# Altium project nRF52840_NanoDevKit.PrjPcb
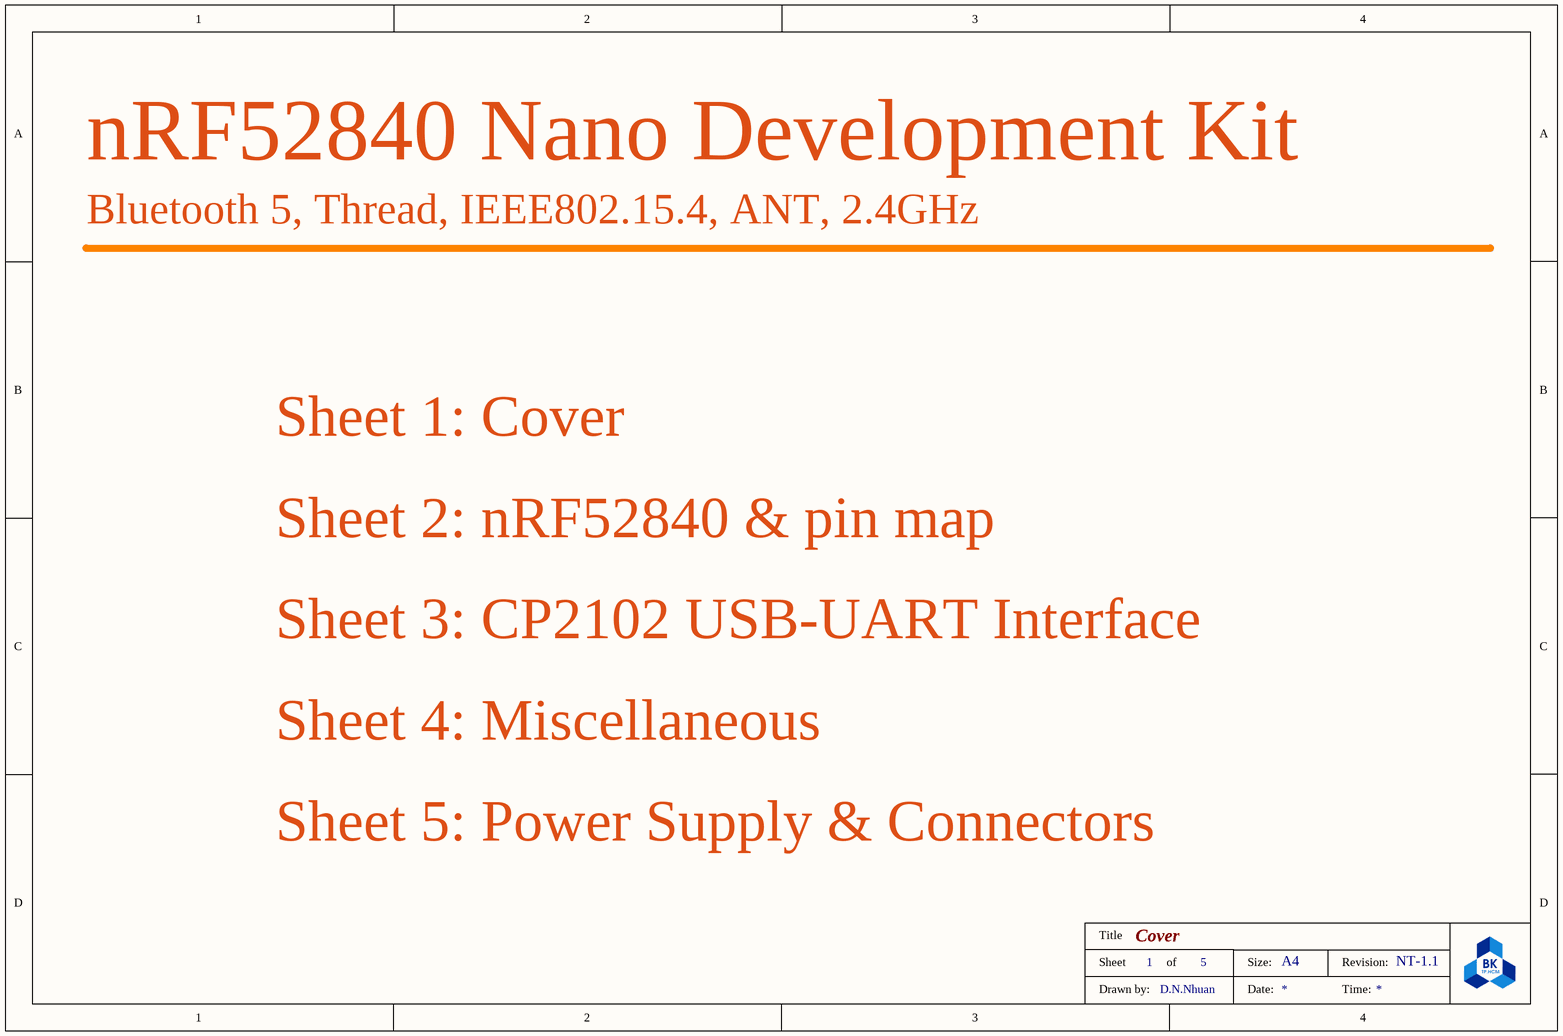
[diagram p0: Sheet1_Cover.SchDoc]
5 sheets, 72 parts. Net scope: flat (ports and power ports of the same name join across sheets).
Board file: PCB_NanoDevKit.PcbDoc
Sheets:
  Sheet1_Cover.SchDoc
  Sheet2_nRF52840_module.SchDoc
  Sheet3_CP2102.SchDoc
  Sheet4_misc.SchDoc
  Sheet5_PowerSupply&Connecters.SchDoc

## Sheet Sheet1_Cover.SchDoc: Cover
size A4; DrawnBy: D.N.Nhuan; Revision: NT-1.1; SheetNumber: 1; SheetTotal: 5

### Notes on the sheet
- nRF52840 Nano Development Kit
- Bluetooth 5, Thread, IEEE802.15.4, ANT, 2.4GHz
- Sheet 1: Cover
- Sheet 2: nRF52840 & pin map
- Sheet 3: CP2102 USB-UART Interface
- Sheet 4: Miscellaneous
- Sheet 5: Power Supply & Connectors
- Title
- Sheet
- of
- Size:
- A4
- Revision:
- Drawn by:
- Date:
- Time:

## Sheet Sheet2_nRF52840_module.SchDoc: nRF52840 module
size A4; DrawnBy: D.N.Nhuan; Revision: NT-1.1; SheetNumber: 2; SheetTotal: 5
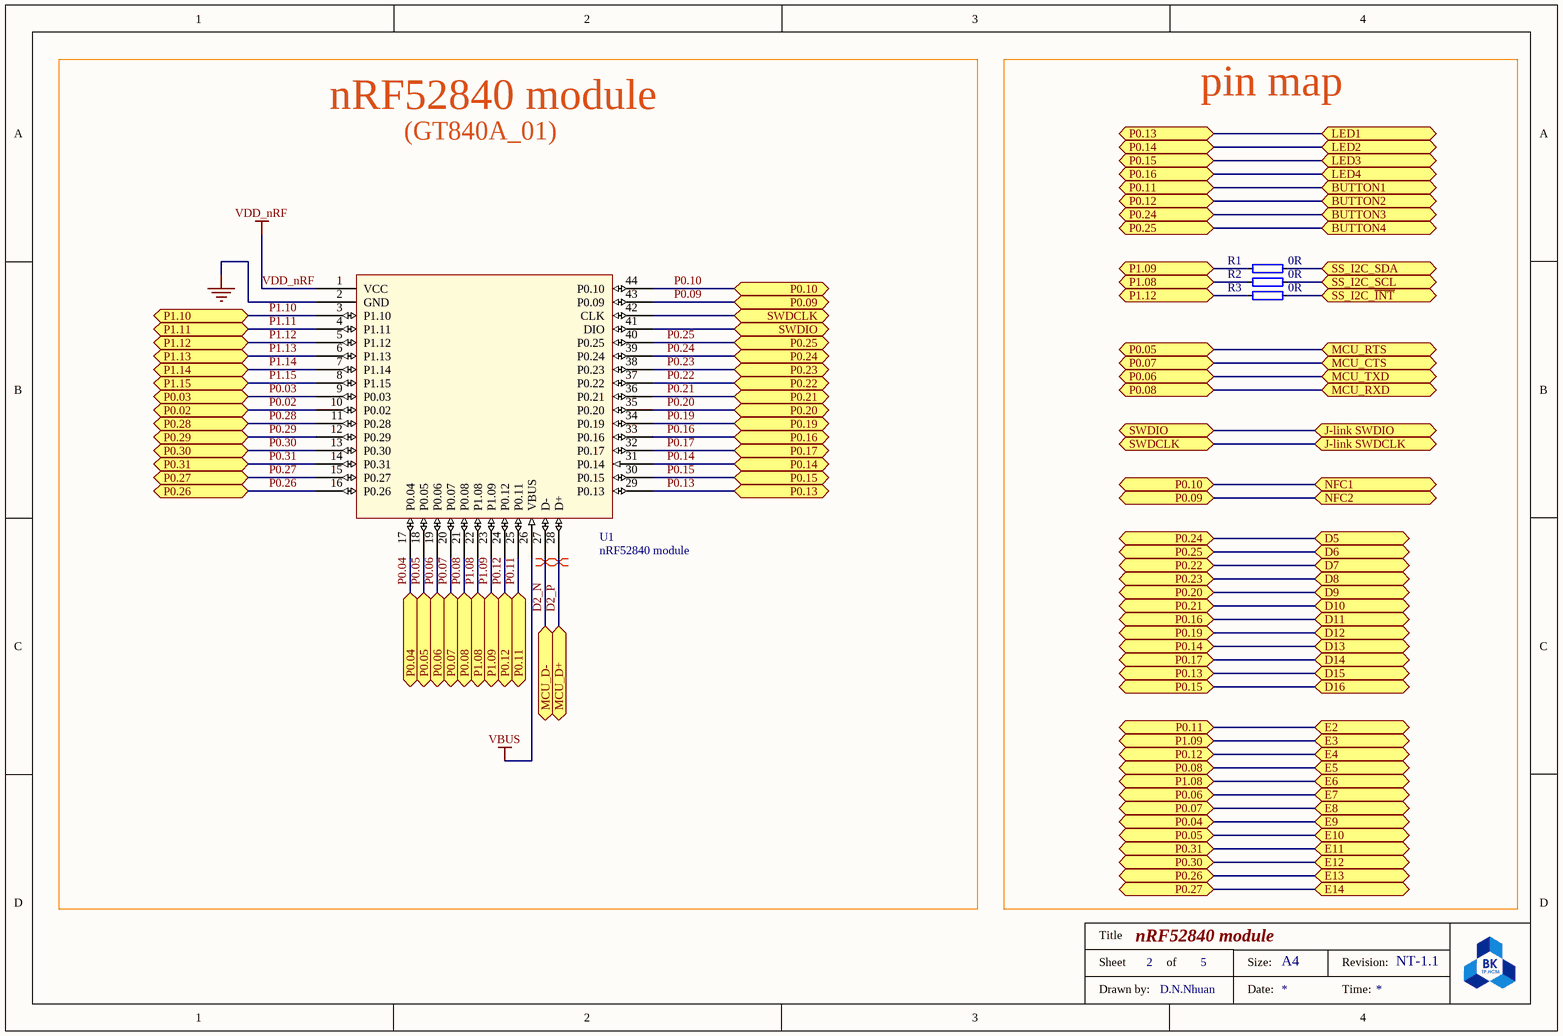
[diagram p1: Sheet2_nRF52840_module.SchDoc]

### Parts
R1  0R  [0402 imperial]
R2  0R  [0402 imperial]
R3  0R  [0402 imperial]
U1  nRF52840 module  [nRF52840_GT840A01]

### Blocks framed on the sheet
nRF52840 module: U1
pin map: R1-R3

### Ports
BUTTON1 (bidir), BUTTON2 (bidir), BUTTON3 (bidir), BUTTON4 (bidir), D5, D6, D7, D8, D9, D10, D11, D12, D13, D14, D15, D16, E2, E3, E4, E5, E6, E7, E8, E9, E10, E11, E12, E13, E14, J-link SWDCLK, J-link SWDIO, LED1 (bidir), LED2 (bidir), LED3 (bidir), LED4 (bidir), MCU_CTS, MCU_D+, MCU_D-, MCU_RTS, MCU_RXD, MCU_TXD, NFC1, NFC2, P0.02, P0.03, P0.04, P0.05, P0.06, P0.07, P0.08, P0.09, P0.10, P0.11, P0.12, P0.13, P0.14, P0.15, P0.16, P0.17, P0.19, P0.20, P0.21, P0.22, P0.23, P0.24, P0.25, P0.26, P0.27, P0.28, P0.29, P0.30, P0.31, P1.08, P1.09, P1.10, P1.11, P1.12, P1.13, P1.14, P1.15, SS_I2C_SCL, SS_I2C_SDA, SS_I2C_~{INT}, SWDCLK, SWDCLK (bidir), SWDIO, SWDIO (bidir)

### Nets
GND: U1.2(GND)
VBUS: U1.26(VBUS)
VDD_nRF: U1.1(VCC)
D2_N: U1.27(D-) ; port MCU_D-
D2_P: U1.28(D+) ; port MCU_D+
P0.02: U1.10(P0.02) ; port P0.02
P0.03: U1.9(P0.03) ; port P0.03
P0.04: U1.17(P0.04) ; port E9, port P0.04
P0.05: U1.18(P0.05) ; port MCU_RTS, port P0.05, port E10
P0.06: U1.19(P0.06) ; port MCU_TXD, port P0.06, port E7
P0.07: U1.20(P0.07) ; port MCU_CTS, port P0.07, port E8
P0.08: U1.21(P0.08) ; port MCU_RXD, port P0.08, port E5
P0.09: U1.43(P0.09) ; port P0.09, port NFC2
P0.10: U1.44(P0.10) ; port P0.10, port NFC1
P0.11: U1.25(P0.11) ; port BUTTON1, port P0.11, port E2
P0.12: U1.24(P0.12) ; port BUTTON2, port P0.12, port E4
P0.13: U1.29(P0.13) ; port LED1, port P0.13, port D15
P0.14: U1.31(P0.14) ; port LED2, port P0.14, port D13
P0.15: U1.30(P0.15) ; port LED3, port P0.15, port D16
P0.16: U1.33(P0.16) ; port LED4, port P0.16, port D11
P0.17: U1.32(P0.17) ; port P0.17, port D14
P0.19: U1.34(P0.19) ; port P0.19, port D12
P0.20: U1.35(P0.20) ; port P0.20, port D9
P0.21: U1.36(P0.21) ; port P0.21, port D10
P0.22: U1.37(P0.22) ; port P0.22, port D7
P0.23: U1.38(P0.23) ; port P0.23, port D8
P0.24: U1.39(P0.24) ; port BUTTON3, port P0.24, port D5
P0.25: U1.40(P0.25) ; port BUTTON4, port P0.25, port D6
P0.26: U1.16(P0.26) ; port P0.26, port E13
P0.27: U1.15(P0.27) ; port P0.27, port E14
P0.28: U1.11(P0.28) ; port P0.28
P0.29: U1.12(P0.29) ; port P0.29
P0.30: U1.13(P0.30) ; port P0.30, port E12
P0.31: U1.14(P0.31) ; port P0.31, port E11
P1.08: R2.1 U1.22(P1.08) ; port E6, port P1.08
P1.09: R1.1 U1.23(P1.09) ; port E3, port P1.09
P1.10: U1.3(P1.10) ; port P1.10
P1.11: U1.4(P1.11) ; port P1.11
P1.12: R3.1 U1.5(P1.12) ; port P1.12
P1.13: U1.6(P1.13) ; port P1.13
P1.14: U1.7(P1.14) ; port P1.14
P1.15: U1.8(P1.15) ; port P1.15
SWDCLK: U1.42(CLK) ; port J-link SWDCLK, port SWDCLK
SWDIO: U1.41(DIO) ; port SWDIO, port J-link SWDIO
NetR1_2: R1.2 ; port SS_I2C_SDA
NetR2_2: R2.2 ; port SS_I2C_SCL
NetR3_2: R3.2 ; port SS_I2C_~{INT}

### Layout directives
differential pair: D2_N, D2_P

### Notes on the sheet
- (GT840A_01)
- Title
- Sheet
- of
- Size:
- A4
- Revision:
- Drawn by:
- Date:
- Time:

### Library data of the parts
R1-R3 = Resistor: General Schematic; Tolerance: ±5%; Value: 0R; Supplier: *; Link of Supplier: *; Footprint: 0402
U1 = nRF52840_GT840A01: nRF52840 module GT840A_01

## Sheet Sheet3_CP2102.SchDoc: CP2102 USB-UART Interface
size A4; DrawnBy: D.N.Nhuan; Revision: NT-1.1; SheetNumber: 3; SheetTotal: 5
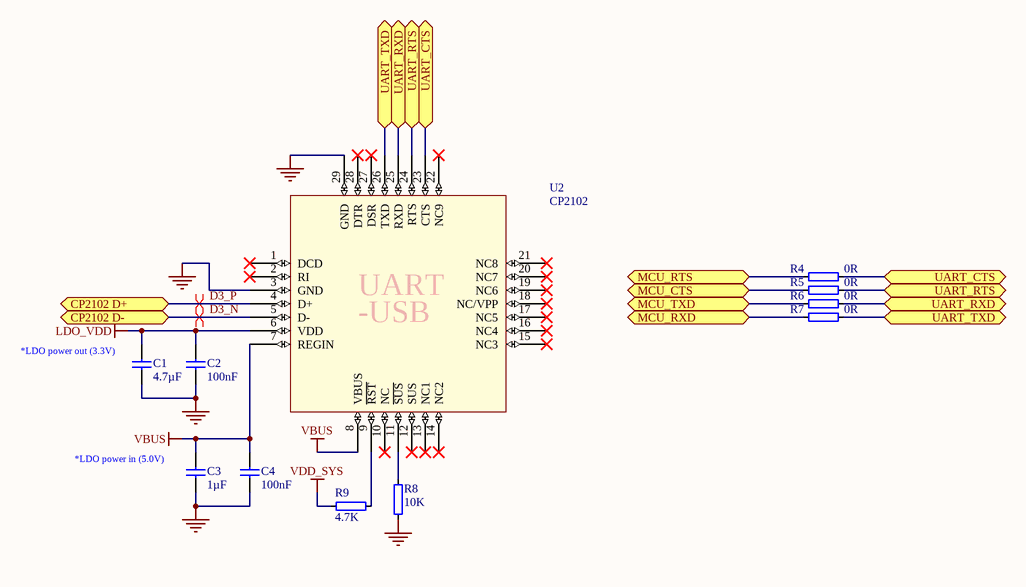
[diagram p2: Sheet3_CP2102.SchDoc]

### Parts
C1  4.7µF  [0603_Imperial]
C2  100nF  [0402 imperial]
C3  1µF  [0603_Imperial]
C4  100nF  [0402 imperial]
R4  0R  [0402 imperial]
R5  0R  [0402 imperial]
R6  0R  [0402 imperial]
R7  0R  [0402 imperial]
R8  10K  [0402 imperial]
R9  4.7K  [0402 imperial]
U2  CP2102  [QFN28-CP2102]

### Ports
CP2102 D+, CP2102 D-, MCU_CTS, MCU_RTS, MCU_RXD, MCU_TXD, UART_CTS, UART_RTS, UART_RXD, UART_TXD

### Nets
GND: C1.1 C2.1 C3.1 C4.1 R8.2 U2.3(GND) U2.29(GND)
LDO_VDD: C1.2 C2.2 U2.6(VDD)
VBUS: C3.2 C4.2 U2.7(REGIN) U2.8(VBUS)
VDD_SYS: R9.2
D3_N: U2.5(D-) ; port CP2102 D-
D3_P: U2.4(D+) ; port CP2102 D+
P0.05: R4.1 ; port MCU_RTS
P0.06: R6.1 ; port MCU_TXD
P0.07: R5.1 ; port MCU_CTS
P0.08: R7.1 ; port MCU_RXD
NetR4_2: R4.2 U2.23(CTS) ; port UART_CTS
NetR5_2: R5.2 U2.24(RTS) ; port UART_RTS
NetR6_2: R6.2 U2.25(RXD) ; port UART_RXD
NetR7_2: R7.2 U2.26(TXD) ; port UART_TXD
NetR8_1: R8.1 U2.11(~{SUS})
NetR9_1: R9.1 U2.9(~{RST})

Not connected (* = marked no-connect by the designer): U2 1(DCD)* 2(RI)* 10(NC)* 12(SUS)* 13(NC1)* 14(NC2)* 15(NC3)* 16(NC4)* 17(NC5)* 18(NC/VPP)* 19(NC6)* 20(NC7)* 21(NC8)* 22(NC9)* 27(DSR)* 28(DTR)*

### Layout directives
differential pair: D3_N, D3_P

### Notes on the sheet
- (near C1) *LDO power out (3.3V)
- (near C3) *LDO power in (5.0V)
- Title
- Sheet
- of
- Size:
- A4
- Revision:
- Drawn by:
- Date:
- Time:
- (in symbol CP2102) UART; -USB

### Library data of the parts
C1-C4 = Capacitor: Genaral Schematic; Tolerance: ±5%; Suppiler: *; Link of Supplier: *; Manufacturer: *; Manufacturer Part Number: *; Footprint: 0402
  C1: Value: 4.7µF
  C2 C4: Value: 100nF
  C3: Value: 1µF
R4-R9 = Resistor: General Schematic; Tolerance: ±5%; Supplier: *; Link of Supplier: *; Footprint: 0402
  R4-R7: Value: 0R
  R8: Value: 10K
  R9: Value: 4.7K
U2 = CP2102: Silicon Labs

## Sheet Sheet4_misc.SchDoc: Misc
size A4; DrawnBy: D.N.Nhuan; Revision: NT-1.1; SheetNumber: 4; SheetTotal: 5
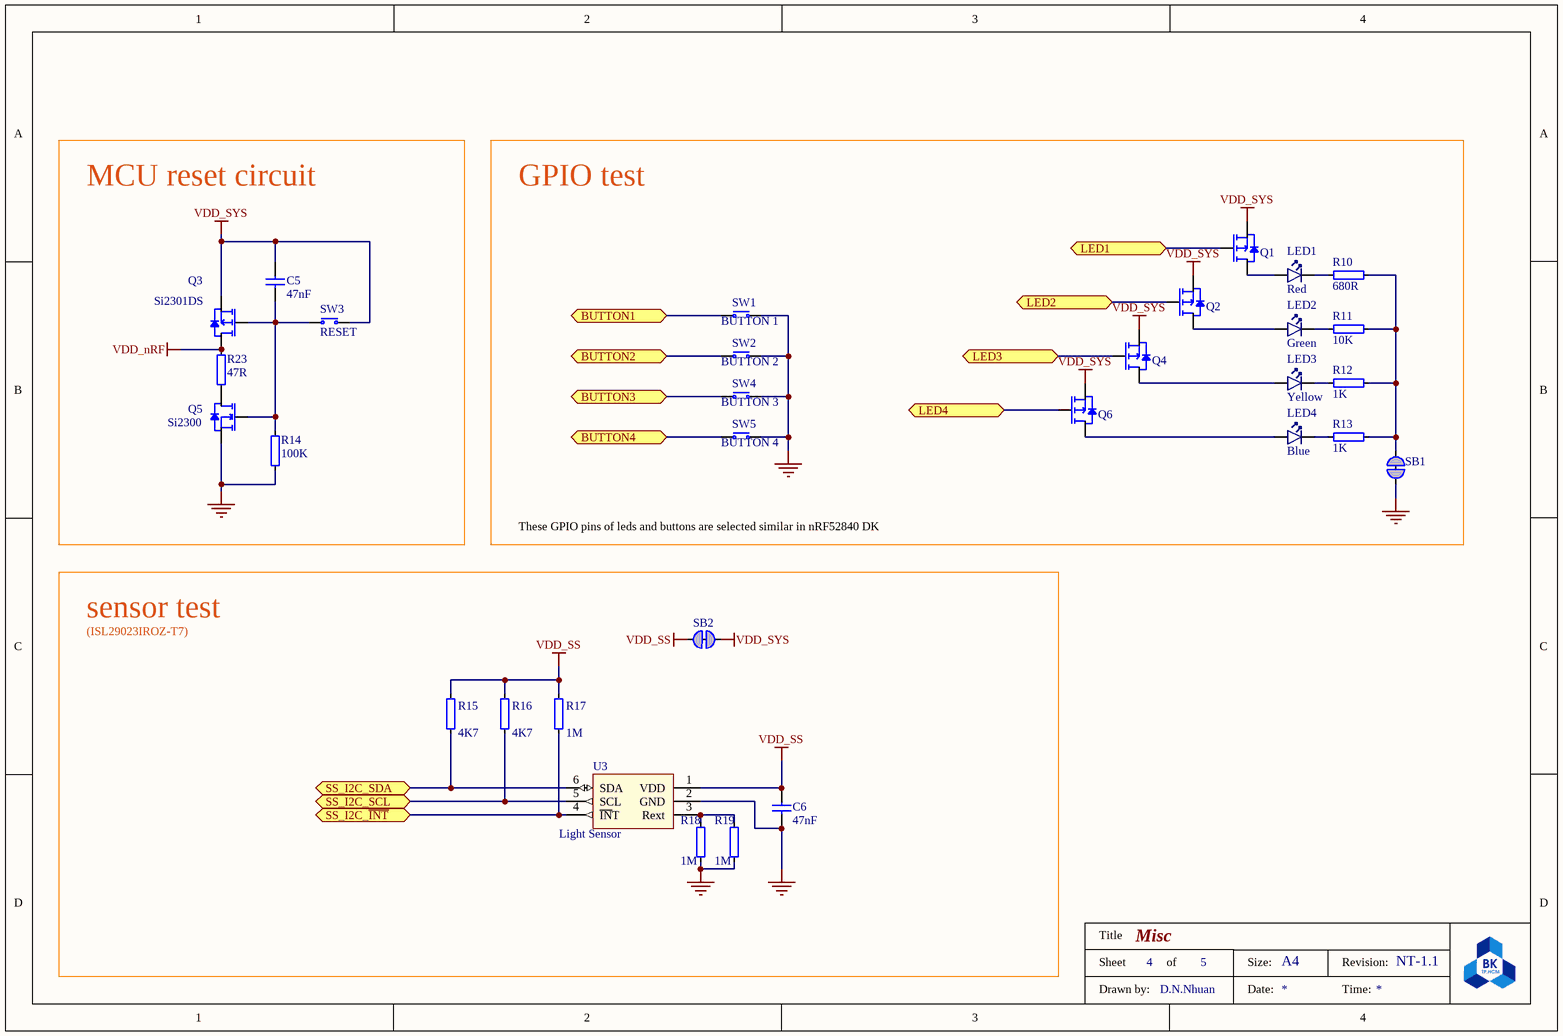
[diagram p3: Sheet4_misc.SchDoc]

### Parts
C5  47nF  [0402 imperial]
C6  47nF  [0402 imperial]
LED1  Red  [LED_0603]
LED2  Green  [LED_0603]
LED3  Yellow  [LED_0603]
LED4  Blue  [LED_0603]
Q1  Si2301DS  [SOT-23]  (value not drawn)
Q2  Si2301DS  [SOT-23]  (value not drawn)
Q3  Si2301DS  [SOT-23]
Q4  Si2301DS  [SOT-23]  (value not drawn)
Q5  Si2300  [SOT-23]
Q6  Si2301DS  [SOT-23]  (value not drawn)
R10  680R  [0805_Imperial]
R11  10K  [0805_Imperial]
R12  1K  [0805_Imperial]
R13  1K  [0805_Imperial]
R14  100K  [0402 imperial]
R15  4K7  [0402 imperial]
R16  4K7  [0402 imperial]
R17  1M  [0402 imperial]
R18  1M  [0402 imperial]
R19  1M  [0402 imperial]
R23  47R  [0805_Imperial]
SB1  Solderbridge  [Solderbridge_Shorted]  (value not drawn)  (net tie, no BOM)
SB2  Solderbridge  [Solderbridge_Shorted]  (value not drawn)  (net tie, no BOM)
SW1  BUTTON 1  [Switch-PB-4.5x4.5mm-SMD]
SW2  BUTTON 2  [Switch-PB-4.5x4.5mm-SMD]
SW3  RESET  [Switch-PB-4.5x4.5mm-SMD]
SW4  BUTTON 3  [Switch-PB-4.5x4.5mm-SMD]
SW5  BUTTON 4  [Switch-PB-4.5x4.5mm-SMD]
U3  Light Sensor  [SON65P200X210X80-7N]

### Blocks framed on the sheet
MCU reset circuit: C5 Q3 Q5 R14 R23 SW3
GPIO test: LED1-LED4 Q1 Q2 Q4 Q6 R10-R13 SB1 SW1 SW2 SW4 SW5
sensor test: C6 R15-R19 SB2 U3

### Ports
BUTTON1 (bidir), BUTTON2 (bidir), BUTTON3 (bidir), BUTTON4 (bidir), LED1 (bidir), LED2 (bidir), LED3 (bidir), LED4 (bidir), SS_I2C_SCL, SS_I2C_SDA, SS_I2C_~{INT}

### Nets
GND: C6.1 Q5.2(S) R14.1 R18.1 R19.1 SB1.2 SW1.1(N.O) SW2.1(N.O) SW4.1(N.O) SW5.1(N.O) U3.2(GND) U3.7(GND)
VDD_nRF: Q3.3(D) R23.2
VDD_SS: C6.2 R15.2 R16.2 R17.2 SB2.2 U3.1(VDD)
VDD_SYS: C5.2 Q1.2(S) Q2.2(S) Q3.2(S) Q4.2(S) Q6.2(S) SB2.1 SW3.1(N.O)
P0.11: SW1.2(COM) ; port BUTTON1
P0.12: SW2.2(COM) ; port BUTTON2
P0.13: Q1.1(G) ; port LED1
P0.14: Q2.1(G) ; port LED2
P0.15: Q4.1(G) ; port LED3
P0.16: Q6.1(G) ; port LED4
P0.24: SW4.2(COM) ; port BUTTON3
P0.25: SW5.2(COM) ; port BUTTON4
NetC5_1: C5.1 Q3.1(G) Q5.1(G) R14.2 SW3.2(COM)
NetLED1_1: LED1.1(C) R10.1
NetLED1_2: LED1.2(A) Q1.3(D)
NetLED2_1: LED2.1(C) R11.1
NetLED2_2: LED2.2(A) Q2.3(D)
NetLED3_1: LED3.1(C) R12.1
NetLED3_2: LED3.2(A) Q4.3(D)
NetLED4_1: LED4.1(C) R13.1
NetLED4_2: LED4.2(A) Q6.3(D)
NetQ5_3: Q5.3(D) R23.1
NetR1_2: R15.1 U3.6(SDA) ; port SS_I2C_SDA
NetR2_2: R16.1 U3.5(SCL) ; port SS_I2C_SCL
NetR3_2: R17.1 U3.4(~{IN}T) ; port SS_I2C_~{INT}
NetR10_2: R10.2 R11.2 R12.2 R13.2 SB1.1
NetR18_2: R18.2 R19.2 U3.3(Rext)

### Notes on the sheet
- These GPIO pins of leds and buttons are selected similar in nRF52840 DK
- (ISL29023IROZ-T7)
- Title
- Sheet
- of
- Size:
- A4
- Revision:
- Drawn by:
- Date:
- Time:

### Library data of the parts
C5 C6 = Capacitor: Genaral Schematic; Tolerance: ±5%; Value: 47nF; Suppiler: *; Link of Supplier: *; Manufacturer: *; Manufacturer Part Number: *; Footprint: 0402
LED1-LED4 = LED: General Schematic; Footprint: 0603
  LED1: Color: Red
  LED2: Color: Green
  LED3: Color: Yellow
  LED4: Color: Blue
Q1-Q4 Q6 = MOS-P: SOT-23 1-G 2-S 3-D
Q5 = MOS-N: SOT-23 1-G 2-S 3-D
R10-R17 R23 = Resistor: General Schematic; Tolerance: ±5%; Supplier: *; Link of Supplier: *; Footprint: 0402
  R10: Value: 680R
  R11: Value: 10K
  R12 R13: Value: 1K
  R14: Value: 100K
  R15 R16: Value: 4K7
  R17: Value: 1M
  R23: Value: 47R
R18 R19 = Resistor: General Schematic; Tolerance: ±1%; Value: 1M; Supplier: thegioiic; Link of Supplier: http://thegioiic.com/products/dien-tro-510k-ohm-0402-1; Footprint: 0402
SB1 SB2 = Solderbridge Shorted: Shorted Solderbridge; Artikkelnr Noca: N.A.; Part Number: Solderbridge Shorted; Manufacturer: *; Manufacturer Part Number: *; Datasheet: *; LatestRevisionDate: 2012-08-07; Pin Count: 2; Publisher: Nordic Semiconductor; Published: 2012-08-07; Value: Solderbridge; Note: *; Supplier: *; Supplier part number: *; 2nd source Supplier: *; 2nd source part number: *; Footprint Doc: Solderbridge_Shorted; Artikkelnr Simpro: N.A.
SW1-SW5 = Switch-PB: Push Button; Manufacturer: *; Manufacturer Part Number: *; Pin Count: 4; Note: *; Part Number: *
  SW1: Value: BUTTON 1
  SW2: Value: BUTTON 2
  SW3: Value: RESET
  SW4: Value: BUTTON 3
  SW5: Value: BUTTON 4
U3 = ISL29023IROZ-T7: Light Sensor, 2.1x2mm; Manufacturer: Intersil; Footprint: DFN 6; Manufacturer Partnumber: ISL29023IROZ-T7; Type Sensor: Light Sensor

## Sheet Sheet5_PowerSupply&Connecters.SchDoc: Power Supply & Connectors
size A4; DrawnBy: D.N.Nhuan; Revision: NT-1.1; SheetNumber: 5; SheetTotal: 5
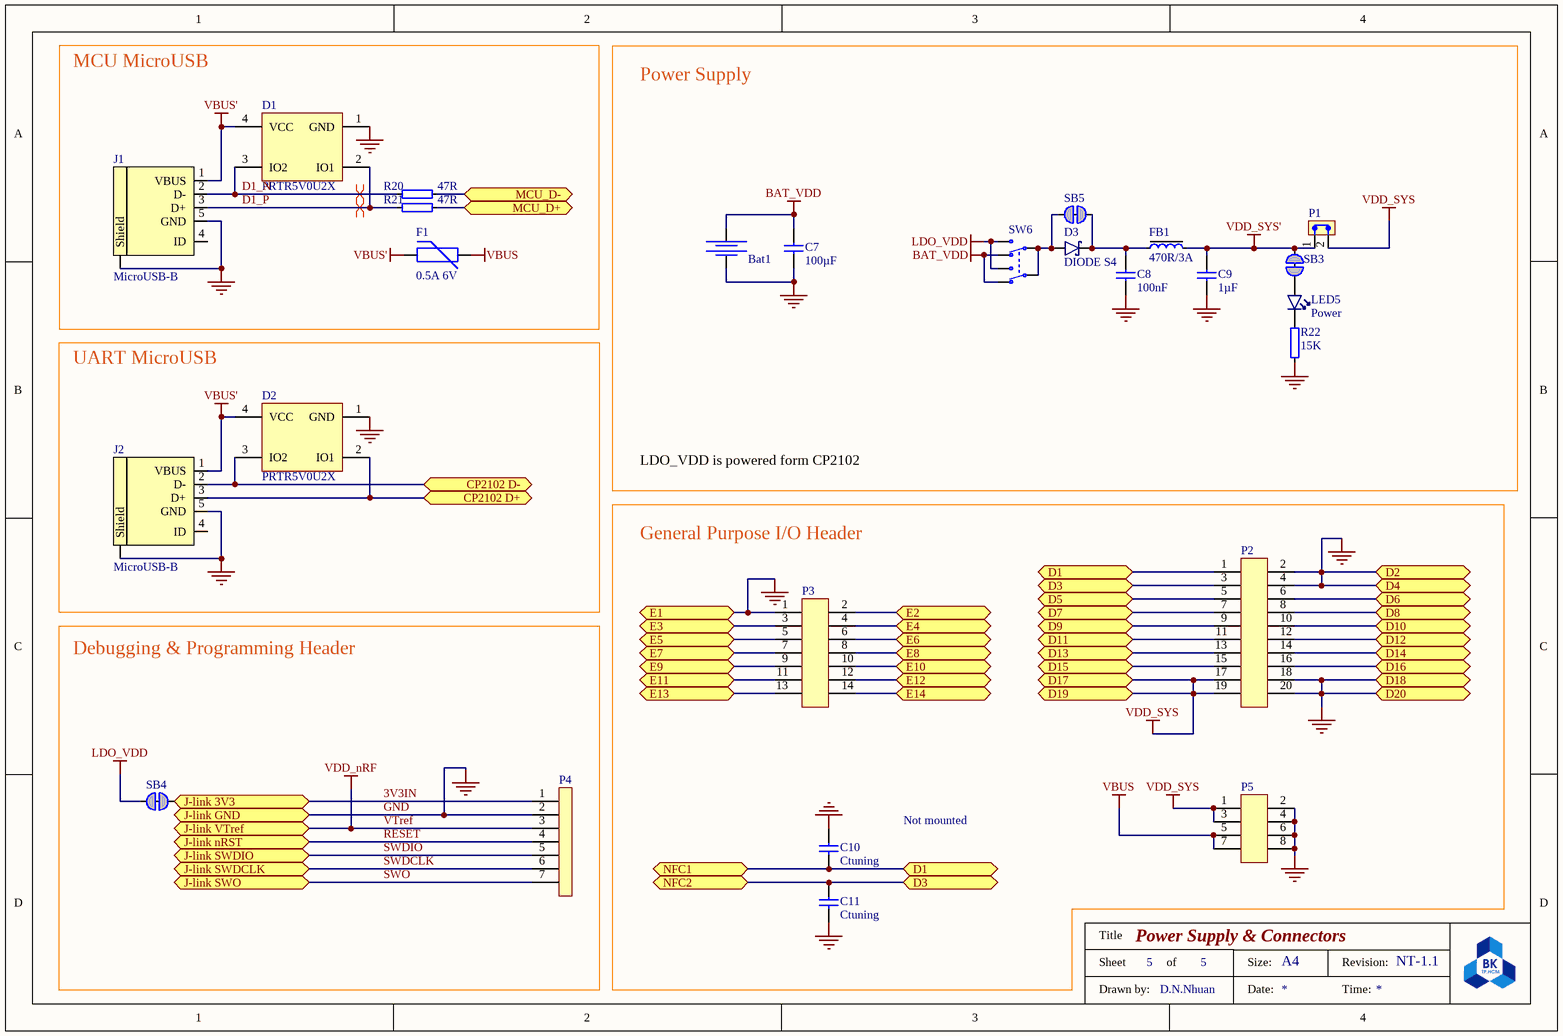
[diagram p4: Sheet5_PowerSupply&Connecters.SchDoc]

### Parts
Bat1  Bat Holder CR2032  [CR2032_HOLDER]  (value not drawn)
C7  100µF  [1210_Imperial]
C8  100nF  [0402 imperial]
C9  1µF  [0603_Imperial]
C10  Ctuning  [0402 imperial]
C11  Ctuning  [0402 imperial]
D1  PRTR5V0U2X  [SOT190P230X110-4L]
D2  PRTR5V0U2X  [SOT190P230X110-4L]
D3  DIODE S4  [SOD-123]
F1  0.5A 6V  [0805_Imperial]
FB1  470R/3A  [0603_Imperial]
J1  MicroUSB-B  [USB-Micro-B-RA-SMD-PiP]
J2  MicroUSB-B  [USB-Micro-B-RA-SMD-PiP]
LED5  Power  [LED_0603]
P1  2p, 2.54mm  [CONN2.54MM2P]  (value not drawn)
P2  10x2, 2.54mm  [CONN2.54MM10X2]  (value not drawn)
P3  2x7p, 2.54mm  [CONN2.54MM7PX2]  (value not drawn)
P4  Debug&Programming  [CONN2.54MM7P]  (value not drawn)
P5  2x4p, 2.54mm  [CONN2.54MM2X4]  (value not drawn)
R20  47R  [0402 imperial]
R21  47R  [0402 imperial]
R22  15K  [0402 imperial]
SB3  Solderbridge  [Solderbridge_Shorted]  (value not drawn)  (net tie, no BOM)
SB4  Solderbridge  [Solderbridge_Shorted]  (value not drawn)  (net tie, no BOM)
SB5  Solderbridge  [Solderbridge_Shorted]  (value not drawn)  (net tie, no BOM)
SW6  MSS22D18  [MSS22D18SMD]  (value not drawn)

### Blocks framed on the sheet
MCU MicroUSB: D1 F1 J1 R20 R21
Power Supply: Bat1 C7-C9 D3 FB1 LED5 P1 R22 SB3 SB5 SW6
UART MicroUSB: D2 J2
General Purpose I/O Header: C10 C11 P2 P3 P5
Debugging & Programming Header: P4 SB4

### Ports
CP2102 D+, CP2102 D-, D1, D2, D3, D4, D5, D6, D7, D8, D9, D10, D11, D12, D13, D14, D15, D16, D17, D18, D19, D20, E1, E2, E3, E4, E5, E6, E7, E8, E9, E10, E11, E12, E13, E14, J-link 3V3, J-link GND, J-link nRST, J-link SWDCLK, J-link SWDIO, J-link SWO, J-link VTref, MCU_D+, MCU_D-, NFC1, NFC2

### Nets
BAT_VDD: Bat1.1 C7.2 SW6.3(N.C-1) SW6.6(N.C-2)
GND: Bat1.2 C7.1 C8.1 C9.1 C10.2 C11.1 D1.1(GND) D2.1(GND) J1.5(GND) J1.6(Shield) J2.5(GND) J2.6(Shield) P2.2 P2.4 P2.18 P2.20 P3.1 P4.2 P5.2 P5.4 P5.6 P5.8 R22.1 ; port J-link GND, port D2, port D4, port D18, port D20, port E1
LDO_VDD: SB4.1 SW6.1(N.O-1) SW6.4(N.O-2)
VBUS: F1.2 P5.5 P5.7
VBUS': D1.4(VCC) D2.4(VCC) F1.1 J1.1(VBUS) J2.1(VBUS)
VDD_nRF: P4.3 ; port J-link VTref  [also labelled VTref]
VDD_SYS: P1.2 P2.17 P2.19 P5.1 P5.3 ; port D17, port D19
VDD_SYS': C9.2 FB1.2 P1.1 SB3.1
3V3IN: P4.1 SB4.2 ; port J-link 3V3
D1_N: D1.3(IO2) J1.2(D-) R20.1
D1_P: D1.2(IO1) J1.3(D+) R21.1
D2_N: R20.2 ; port MCU_D-
D2_P: R21.2 ; port MCU_D+
D3_N: D2.3(IO2) J2.2(D-) ; port CP2102 D-
D3_P: D2.2(IO1) J2.3(D+) ; port CP2102 D+
P0.04: P3.9 ; port E9
P0.05: P3.10 ; port E10
P0.06: P3.7 ; port E7
P0.07: P3.8 ; port E8
P0.08: P3.5 ; port E5
P0.09: C11.2 P2.3 ; port D3, port NFC2
P0.10: C10.1 P2.1 ; port D1, port NFC1
P0.11: P3.2 ; port E2
P0.12: P3.4 ; port E4
P0.13: P2.15 ; port D15
P0.14: P2.13 ; port D13
P0.15: P2.16 ; port D16
P0.16: P2.11 ; port D11
P0.17: P2.14 ; port D14
P0.19: P2.12 ; port D12
P0.20: P2.9 ; port D9
P0.21: P2.10 ; port D10
P0.22: P2.7 ; port D7
P0.23: P2.8 ; port D8
P0.24: P2.5 ; port D5
P0.25: P2.6 ; port D6
P0.26: P3.13 ; port E13
P0.27: P3.14 ; port E14
P0.30: P3.12 ; port E12
P0.31: P3.11 ; port E11
P1.08: P3.6 ; port E6
P1.09: P3.3 ; port E3
RESET: P4.4 ; port J-link nRST
SWDCLK: P4.6 ; port J-link SWDCLK
SWDIO: P4.5 ; port J-link SWDIO
SWO: P4.7 ; port J-link SWO
NetC8_2: C8.2 D3.1(C) FB1.1 SB5.1
NetD3_2: D3.2(A) SB5.2 SW6.2(COM-1) SW6.5(COM-2)
NetLED5_1: LED5.1(C) R22.2
NetLED5_2: LED5.2(A) SB3.2

Not connected (* = marked no-connect by the designer): J1 4(ID); J2 4(ID)

### Layout directives
differential pair: D1_N, D1_P

### Notes on the sheet
- LDO_VDD is powered form CP2102
- Not mounted
- Title
- Sheet
- of
- Size:
- A4
- Revision:
- Drawn by:
- Date:
- Time:

### Library data of the parts
Bat1 = Bat Holder CR2032: Bat Holder CR2032 SMD; Note: Bat Holder CR2032
C7-C11 = Capacitor: Genaral Schematic; Tolerance: ±5%; Suppiler: *; Link of Supplier: *; Manufacturer: *; Manufacturer Part Number: *; Footprint: 0402
  C7: Value: 100µF
  C8: Value: 100nF
  C9: Value: 1µF
  C10 C11: Value: Ctuning
D1 D2 = PRTR5V0U2X: Ultra low capacitance double rail-to-rail ESD protection diode; Manufacturer: NXP; 2nd source part number: 152-4157; Artikkelnr Noca: 10069015; Artikkelnr Simpro: N.A.; Part Number: PRTR5V0U2X; Manufacturer Part Number: PRTR5V0U2X; Datasheet: http://www.farnell.com/datasheets/109718.pdf; LatestRevisionDate: 2012-06-11; Publisher: Nordic Semiconductor; Published: 2012-06-11; Value: PRTR5V0U2X; Note: *; Supplier: Digi-Key; Supplier part number: 568-4140-1-ND; 2nd source Supplier: Farnell; Footprint Doc: SOT-143B
D3 = Diode Schottky: Value: DIODE S4; Note: *
F1 = Fuse: Fuse Fuse Fuse; Value: 0.5A 6V
FB1 = Ferrite Bead: General FB; Footprint: 0603; Value: 470R/3A
J1 J2 = MiniUSB-AB-SMT: MicroUSB-B-SMT; Manufacturer: Allen Creations Corp.; Manufacturer Part Number: AJU55-BS2111-L; 2nd source part number: 609-4616-1-ND; Part number IPS: 00000007790; Artikkelnr Noca: 55029020; Artikkelnr Simpro: N.A.; Part Number: USB-Micro-B-RA-SMD-PiP; Datasheet: \\hizz\pro\app9717\Datasheet\connectores\Allen Creations Corp\AJU-211.pdf; Footprint Doc: USB-Micro-B-RA-SMD-PiP; LatestRevisionDate: 2016-04-21; Pin Count: 5; Publisher: Nordic Semiconductor; Published: 2014-10-07; Value: MicroUSB-B; Note: *; Supplier: Cabcon; Supplier part number: AJU55-BS2111-L; 2nd source Supplier: Digi-Key
LED5 = LED: General Schematic; Color: Green; Footprint: 0603; Indicate: Power
P1 = Headerx 2: Value: 2p, 2.54mm
P2 = Header 10x2: General Schematic; Value: 10x2, 2.54mm
P3 = Header 7x2: General Schematic; Value: 2x7p, 2.54mm
P4 = Header 7: General Schematic; Value: Debug&Programming
P5 = Header 4x2: General Schematic; Value: 2x4p, 2.54mm
R20-R22 = Resistor: General Schematic; Tolerance: ±5%; Supplier: *; Link of Supplier: *; Footprint: 0402
  R20 R21: Value: 47R
  R22: Value: 15K
SB3-SB5 = Solderbridge Shorted: as SB1 on sheet Sheet4_misc; Part Number: Solderbridge Shorted; Manufacturer: *; Manufacturer Part Number: *; Datasheet: *; LatestRevisionDate: 2012-08-07; Pin Count: 2; Publisher: Nordic Semiconductor; Published: 2012-08-07; Value: Solderbridge; Note: *; Supplier: *; Supplier part number: *; 2nd source Supplier: *; 2nd source part number: *; Footprint Doc: Solderbridge_Shorted; Artikkelnr Simpro: N.A.
SW6 = MSS22D18: Slide Switch DPDT; Part Number: *; Manufacturer Part Number: *; Pin Count: 6; Value: MSS22D18; Note: *

## Nets that join several sheets
GND: Sheet2_nRF52840_module (U1.2), Sheet3_CP2102 (7 pins), Sheet4_misc (12 pins), Sheet5_PowerSupply&Connecters (23 pins)
LDO_VDD: Sheet3_CP2102 (C1.2 C2.2 U2.6), Sheet5_PowerSupply&Connecters (SB4.1 SW6.1 SW6.4)
VBUS: Sheet2_nRF52840_module (U1.26), Sheet3_CP2102 (C3.2 C4.2 U2.7 U2.8), Sheet5_PowerSupply&Connecters (F1.2 P5.5 P5.7)
VDD_nRF: Sheet2_nRF52840_module (U1.1), Sheet4_misc (Q3.3 R23.2), Sheet5_PowerSupply&Connecters (P4.3)
VDD_SYS: Sheet3_CP2102 (R9.2), Sheet4_misc (8 pins), Sheet5_PowerSupply&Connecters (5 pins)
D2_N: Sheet2_nRF52840_module (U1.27), Sheet5_PowerSupply&Connecters (R20.2)
D2_P: Sheet2_nRF52840_module (U1.28), Sheet5_PowerSupply&Connecters (R21.2)
D3_N: Sheet3_CP2102 (U2.5), Sheet5_PowerSupply&Connecters (D2.3 J2.2)
D3_P: Sheet3_CP2102 (U2.4), Sheet5_PowerSupply&Connecters (D2.2 J2.3)
NetR1_2: Sheet2_nRF52840_module (R1.2), Sheet4_misc (R15.1 U3.6)
NetR2_2: Sheet2_nRF52840_module (R2.2), Sheet4_misc (R16.1 U3.5)
NetR3_2: Sheet2_nRF52840_module (R3.2), Sheet4_misc (R17.1 U3.4)
P0.04: Sheet2_nRF52840_module (U1.17), Sheet5_PowerSupply&Connecters (P3.9)
P0.05: Sheet2_nRF52840_module (U1.18), Sheet3_CP2102 (R4.1), Sheet5_PowerSupply&Connecters (P3.10)
P0.06: Sheet2_nRF52840_module (U1.19), Sheet3_CP2102 (R6.1), Sheet5_PowerSupply&Connecters (P3.7)
P0.07: Sheet2_nRF52840_module (U1.20), Sheet3_CP2102 (R5.1), Sheet5_PowerSupply&Connecters (P3.8)
P0.08: Sheet2_nRF52840_module (U1.21), Sheet3_CP2102 (R7.1), Sheet5_PowerSupply&Connecters (P3.5)
P0.09: Sheet2_nRF52840_module (U1.43), Sheet5_PowerSupply&Connecters (C11.2 P2.3)
P0.10: Sheet2_nRF52840_module (U1.44), Sheet5_PowerSupply&Connecters (C10.1 P2.1)
P0.11: Sheet2_nRF52840_module (U1.25), Sheet4_misc (SW1.2), Sheet5_PowerSupply&Connecters (P3.2)
P0.12: Sheet2_nRF52840_module (U1.24), Sheet4_misc (SW2.2), Sheet5_PowerSupply&Connecters (P3.4)
P0.13: Sheet2_nRF52840_module (U1.29), Sheet4_misc (Q1.1), Sheet5_PowerSupply&Connecters (P2.15)
P0.14: Sheet2_nRF52840_module (U1.31), Sheet4_misc (Q2.1), Sheet5_PowerSupply&Connecters (P2.13)
P0.15: Sheet2_nRF52840_module (U1.30), Sheet4_misc (Q4.1), Sheet5_PowerSupply&Connecters (P2.16)
P0.16: Sheet2_nRF52840_module (U1.33), Sheet4_misc (Q6.1), Sheet5_PowerSupply&Connecters (P2.11)
P0.17: Sheet2_nRF52840_module (U1.32), Sheet5_PowerSupply&Connecters (P2.14)
P0.19: Sheet2_nRF52840_module (U1.34), Sheet5_PowerSupply&Connecters (P2.12)
P0.20: Sheet2_nRF52840_module (U1.35), Sheet5_PowerSupply&Connecters (P2.9)
P0.21: Sheet2_nRF52840_module (U1.36), Sheet5_PowerSupply&Connecters (P2.10)
P0.22: Sheet2_nRF52840_module (U1.37), Sheet5_PowerSupply&Connecters (P2.7)
P0.23: Sheet2_nRF52840_module (U1.38), Sheet5_PowerSupply&Connecters (P2.8)
P0.24: Sheet2_nRF52840_module (U1.39), Sheet4_misc (SW4.2), Sheet5_PowerSupply&Connecters (P2.5)
P0.25: Sheet2_nRF52840_module (U1.40), Sheet4_misc (SW5.2), Sheet5_PowerSupply&Connecters (P2.6)
P0.26: Sheet2_nRF52840_module (U1.16), Sheet5_PowerSupply&Connecters (P3.13)
P0.27: Sheet2_nRF52840_module (U1.15), Sheet5_PowerSupply&Connecters (P3.14)
P0.30: Sheet2_nRF52840_module (U1.13), Sheet5_PowerSupply&Connecters (P3.12)
P0.31: Sheet2_nRF52840_module (U1.14), Sheet5_PowerSupply&Connecters (P3.11)
P1.08: Sheet2_nRF52840_module (R2.1 U1.22), Sheet5_PowerSupply&Connecters (P3.6)
P1.09: Sheet2_nRF52840_module (R1.1 U1.23), Sheet5_PowerSupply&Connecters (P3.3)
SWDCLK: Sheet2_nRF52840_module (U1.42), Sheet5_PowerSupply&Connecters (P4.6)
SWDIO: Sheet2_nRF52840_module (U1.41), Sheet5_PowerSupply&Connecters (P4.5)